# Altium schematic sheet A-Headers.SchDoc: HM-CORE Connectors
size A4; Organization: Trenz Electronic GmbH; Revision: A; SheetNumber: 12; SheetTotal: 12; Date: 08.07.2015; Author: Indrek Tubalkain; CompanyName: Trenz Electronic GmbH; DrawnBy: Indrek Tubalkain; Engineer: Indrek Tubalkain; ProjectName: TE0723 Arduino
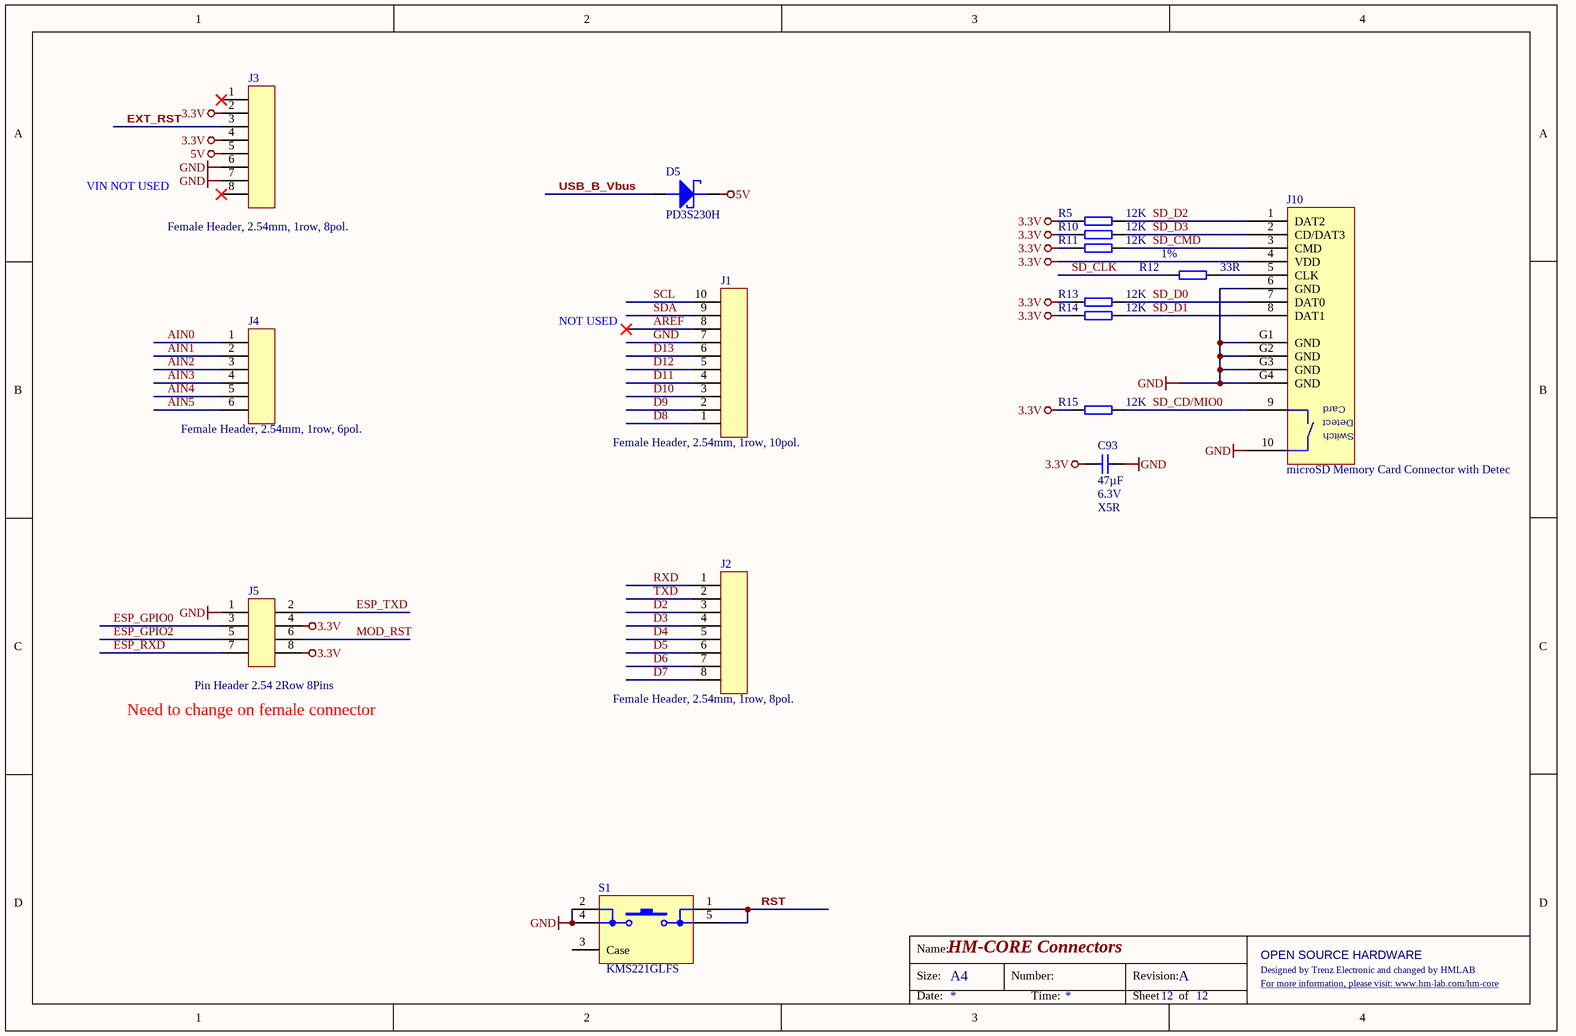
[diagram p0: A-Headers.SchDoc]

## Parts
C93  47µF  Voltage: 6.3V  Technology: X5R  [CAPC2012X135N]
D5  PD3S230H  [PowerDI323]
J1  Female Header, 2.54mm, 1row, 10pol.  [BUCHSENLEISTE-2.54-10-1R]
J2  Female Header, 2.54mm, 1row, 8pol.  [BUCHSENLEISTE-2.54-8-1R]
J3  Female Header, 2.54mm, 1row, 8pol.  [BUCHSENLEISTE-2.54-8-1R]
J4  Female Header, 2.54mm, 1row, 6pol.  [BUCHSENLEISTE-2.54-6-1R]
J5  Pin Header 2.54 2Row 8Pins  [STIFTLEISTE2_54 OG 2R-8]
J10  microSD Memory Card Connector with Detec  [104031-0811]
R5  12K  [RESC1005X40N]
R10  12K  [RESC1005X40N]
R11  12K  [RESC1005X40N]
R12  33R  Tolerance: 1%  [RESC0603X26N]
R13  12K  [RESC1005X40N]
R14  12K  [RESC1005X40N]
R15  12K  [RESC1005X40N]
S1  KMS221GLFS  [KMS2xxGLFS]

## Nets
3.3V: C93.1 J3.2 J3.4 J5.4 J5.8 J10.4(VDD) R5.1 R10.1 R11.1 R13.1 R14.1 R15.1
5V: D5.1(KATHODE) J3.5
GND: C93.2 J1.7 J3.6 J3.7 J5.1 J10.6(GND) J10.10(CDSW) J10.G1(GND) J10.G2(GND) J10.G3(GND) J10.G4(GND) S1.2 S1.4
AIN0: J4.1
AIN1: J4.2
AIN2: J4.3
AIN3: J4.4
AIN4: J4.5
AIN5: J4.6
AREF: J1.8
D2: J2.3
D3: J2.4
D4: J2.5
D5: J2.6
D6: J2.7
D7: J2.8
D8: J1.1
D9: J1.2
D10: J1.3
D11: J1.4
D12: J1.5
D13: J1.6
ESP_GPIO0: J5.3
ESP_GPIO2: J5.5
ESP_RXD: J5.7
ESP_TXD: J5.2
EXT_RST: J3.3
MOD_RST: J5.6
RST: S1.1 S1.5
RXD: J2.1
SCL: J1.10
SD_CD/MIO0: J10.9(CDSW) R15.2
SD_CLK: R12.1
SD_CMD: J10.3(CMD) R11.2
SD_D0: J10.7(DAT0) R13.2
SD_D1: J10.8(DAT1) R14.2
SD_D2: J10.1(DAT2) R5.2
SD_D3: J10.2(CD/DAT3) R10.2
SDA: J1.9
TXD: J2.2
USB_B_Vbus: D5.2(ANODE)
NetJ10_5: J10.5(CLK) R12.2

Not connected (* = marked no-connect by the designer): J3 1* 8*; S1 3(Case)

## Notes on the sheet
- VIN NOT USED
- NOT USED
- (near J5) Need to change on female connector
- Name:
- Size:
- A4
- Number:
- Revision:
- Designed by Trenz Electronic and changed by HMLAB
- OPEN SOURCE HARDWARE
- For more information, please visit: www.hm-lab.com/hm-core <http://hm-lab.com/hm-core>
- Date:
- Time:
- Sheet
- of
- (in symbol 26322) Card; Detect; Switch

## Library data of the parts
C93 = 24718: KON 47µF 6,3V  X5R SMD 20%; AN: 24718; Mixed: SMT; Value: 47u; Preferred: Yes; Case: 2012 (0805); Tolerance: 20%
D5 = 24682: AN: 24682; Mixed: SMT; Case: PowerDI323; HelpURL: B:\AD\adlib\datasheet\PD3S230H
J1 = 26386: Buchsenleiste 1 reihig präz. 10 pol.; AN: 26386; Mixed: THT
J2 J3 = 26387: Buchsenleiste 1 reihig präz. 8 pol.; AN: 26387; Mixed: THT
J4 = 26388: Buchsenleiste 1 reihig präz. 6 pol.; AN: 26388; Mixed: THT
J5 = 23904: Stiftleiste gerade 2-reihig, 8pol.; AN: 23904; Mixed: THT; Trenz-Stock: Yes
J10 = 26322: microSD Memory Card Connector with Detect Switch; AN: 26322; Mixed: SMT; Trenz-Stock: Yes; Case: microSD; HelpURL: B:\AD\adlib\datasheet\104031-0811
R5 R10 R11 R13-R15 = 22598: WID SMD 12K 1% 0,063W; AN: 22598; Mixed: SMT; Preferred: Yes; Case: 1005 (0402); Value: 12K
R12 = 25021: WID SMD 33R 1% 0,05W; AN: 25021; Mixed: SMT; Value: 33; Preferred: Yes; Case: 0603 (0201); HelpURL: B:\AD\adlib\datasheet\R0201
S1 = 26229: KMS221GLFS - SWITCH, SPST, 0.05A, 32VDC, SMD; AN: 26229; Mixed: SMT; HelpURL: B:\AD\adlib\datasheet\KMS